# EAGLE design WSTL18_UART (EAGLE 7.7.0)
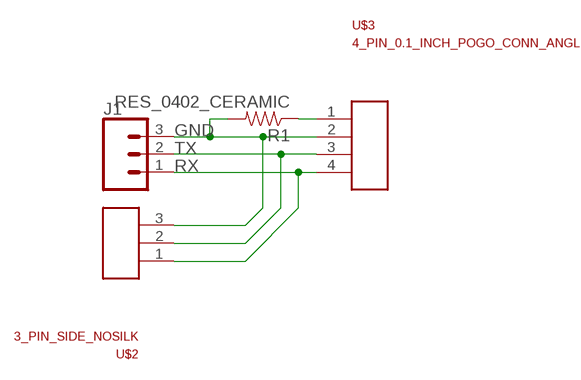
[diagram p0: schematic, sheet 1]

## Parts
J1  CONN_03  [1X03]
R1  RES_0402_CERAMIC  [RES_0402]
U$2  3_PIN_SIDE_NOSILK  [3PIN_SIDE_0.1_INCH_NOSILK]
U$3  4_PIN_0.1_INCH_POGO_CONN_ANGLE  [4_PIN_0.1INCH_POGO_PADS_ANGLE]

## Nets
GND [GND]: J1.3 R1.1 U$2.3 U$3.2
INT0: R1.2 U$3.1
RX: J1.1 U$2.1 U$3.4
TX: J1.2 U$2.2 U$3.3

## Library data of the parts
J1 = SparkFun-Connectors:CONN_03: Multi connection point. Often used as Generic Header-pin footprint for 0.1 inch spaced/style header connections On any of the 0.1 inch spaced packages, you can populate with these: Break Away Headers - Straight <https://www.sparkfun.com/products/116> (PRT-00116) Break Away Male Headers - Right Angle <https://www.sparkfun.com/products/553> (PRT-00553) Female Headers <https://www.sparkfun.com/products/115> (PRT-00115) Break Away Headers - Machine Pin <https://www.sparkfun.com/products/117> (PRT-00117) Break Away Female Headers - Swiss Machine Pin <https://www.sparkfun.com/products/743> (PRT-00743) Stackable Header - 3 Pin (Female, 0.1") <https://www.sparkfun.com/products/13875> (PRT-13875) For SCREWTERMINALS and SPRING TERMINALS visit here: Screw Terimnals on SparkFun.com <https://www.sparkfun.com/search/results?term=Screw+Terminals> (5mm/3.5mm/2.54mm spacing) This device is also useful as a general connection point to wire up your design to another part of your project. Our various solder wires solder well into these plated through hole pads. Hook-Up Wire - Assortment (Stranded, 22 AWG) <https://www.sparkfun.com/products/11375> (PRT-11375) Hook-Up Wire - Assortment (Solid Core, 22 AWG) <https://www.sparkfun.com/products/11367> (PRT-11367) View the entire wire category on our website here <https://www.sparkfun.com/categories/141> Special notes: Molex polarized connector foot print use with SKU : PRT-08232 with associated crimp pins and housings.
R1 = Passives:RES_0402_CERAMIC
U$2 = Connectors:3_PIN_SIDE_NOSILK
U$3 = Connectors:4_PIN_0.1_INCH_POGO_CONN_ANGLE

## Net classes
0 default: width 0.203 mm, drill 0.305 mm, clearance 0.203 mm
1 GND: width 0.254 mm, drill 0.305 mm, clearance 0.254 mm
2 signal: width 0.203 mm, drill 0.305 mm, clearance 0.203 mm

## Board
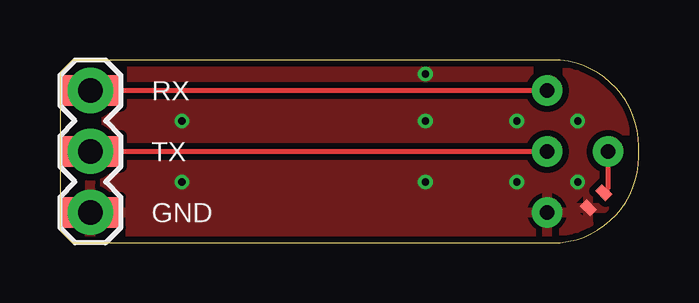
[diagram p1: board, top side]
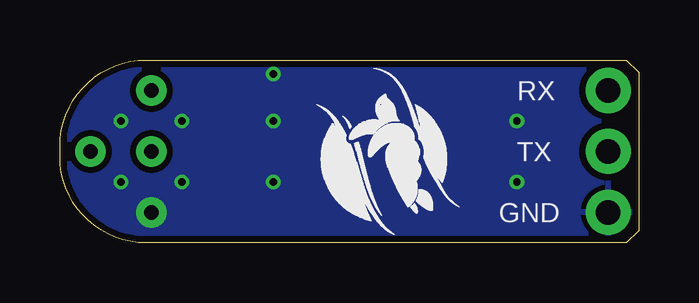
[diagram p2: board, bottom side, seen from below]

Size 24.13 x 7.62 mm. Coordinates in mm from the lower left corner, seen from the top.
Outline: 0.51,7.62 0,7.11 0,0.51 0.51,0 20.54,0 arc90 24.13,3.59 24.13,4.03 arc90 20.54,7.62 0.51,7.62
Copper layers (1*16): Top 0.035mm / dielectric 1.5mm / Bottom 0.035mm
Design rules "Nikos-SeeedStudio_2layer_DRU_no_angle_20140221": minimum track width 6mil, minimum drill 12mil, track to track 6mil, track to pad 10mil, pad to pad 10mil, via to via 10mil, smd to smd 6mil, copper to edge 10mil, drill to drill 10mil, minimum pad ring 10mil, minimum via ring 6mil, stop-mask expansion 0mil, vias tented up to drill 100mil, thermal gap 8mil

### Footprints (pad centres in the part's own frame; a part is rotated, then mirrored left to right if it is on the bottom)
1X03 = drill 1.016 pad 1.88: 1 0,0; 2 2.54,0; 3 5.08,0
RES_0402 = smd 0.4 x 0.6: 1 -0.45,0; 2 0.45,0
3PIN_SIDE_0.1_INCH_NOSILK = smd 1.27 x 2.54: 1 -2.54,-1.27; 2 0,-1.27; 3 2.54,-1.27
4_PIN_0.1INCH_POGO_PADS_ANGLE = smd 1.27 x 1.27: 1 -2.54,2.54; 2 0,0; 3 -2.54,0; 4 -5.08,0

### Placement (x,y rotation side)
J1  1.27,6.35 270 top
R1  22.35,1.78 45 top
U$2  2.54,3.81 270 top
U$3  20.32,1.27 270 top

### Tracks (layer width: path | path; a pad name or v marks a point on that pad's centre or on a via)
GND  (via drill 0.3, 0.6 pad 1.27)
  other vias: 21.59,5.08 15.24,2.54 5.08,2.54 5.08,5.08 21.59,2.54 15.24,5.08 19.05,5.08 20.32,1.27 19.05,2.54 15.24,7.04
  pour Bottom: 0,0 0,7.62 24.13,7.62 24,0
  pour Top: 0,7.62 24.13,7.62 24.13,0 0,0
INT0  (via drill 0.6 pad 1.27)
  Top 0.203: R1.2 22.86,2.29 U$3.1
  other vias: 22.86,3.81
RX  (via drill 0.6 pad 1.27)
  Top 0.203: U$2.1 U$3.4
  other vias: 20.32,6.35
TX  (via drill 0.6 pad 1.27)
  Top 0.203: U$2.2 U$3.3
  other vias: 20.32,3.81

### Text on the board
tNames: RX | TX | GND
bNames: RX | TX | GND